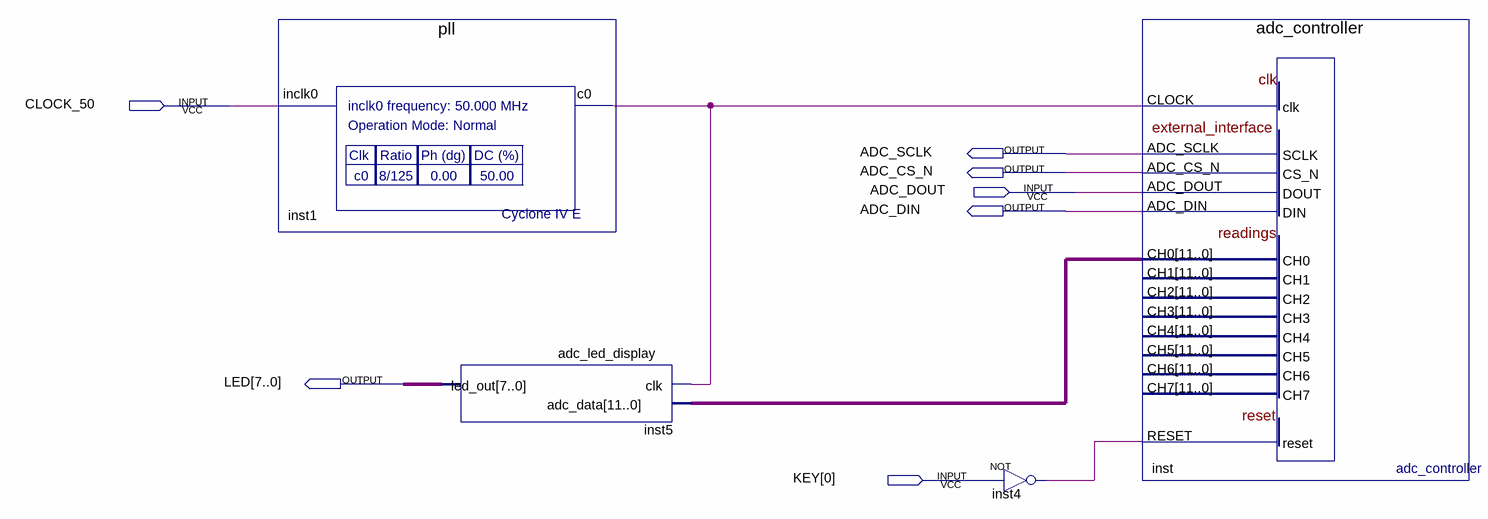
[diagram p0: schematic sheet]
// Quartus schematic block-top.bdf as structural Verilog: 4 symbols, 7 pins
module \block-top  (
  input  CLOCK_50,
  input  ADC_DOUT,
  input  [0:0] KEY,
  output ADC_SCLK,
  output ADC_CS_N,
  output ADC_DIN,
  output [7:0] LED
);

  wire inst1_c0, inst4_out;
  wire [11:0] inst_ch0;

  pll inst1 (.inclk0(CLOCK_50), .c0(inst1_c0));
  adc_led_display inst5 (.clk(inst1_c0), .adc_data(inst_ch0), .led_out(LED));
  not inst4 (inst4_out, KEY[0]);
  adc_controller inst (
    .CLOCK(inst1_c0), .ADC_DOUT(ADC_DOUT), .RESET(inst4_out), .ADC_SCLK(ADC_SCLK), .ADC_CS_N(ADC_CS_N),
    .ADC_DIN(ADC_DIN), .CH0(inst_ch0));  // open: CH1, CH2, CH3, CH4, CH5, CH6, CH7
endmodule
